# EAGLE design pcbnano (EAGLE 7.7.0)
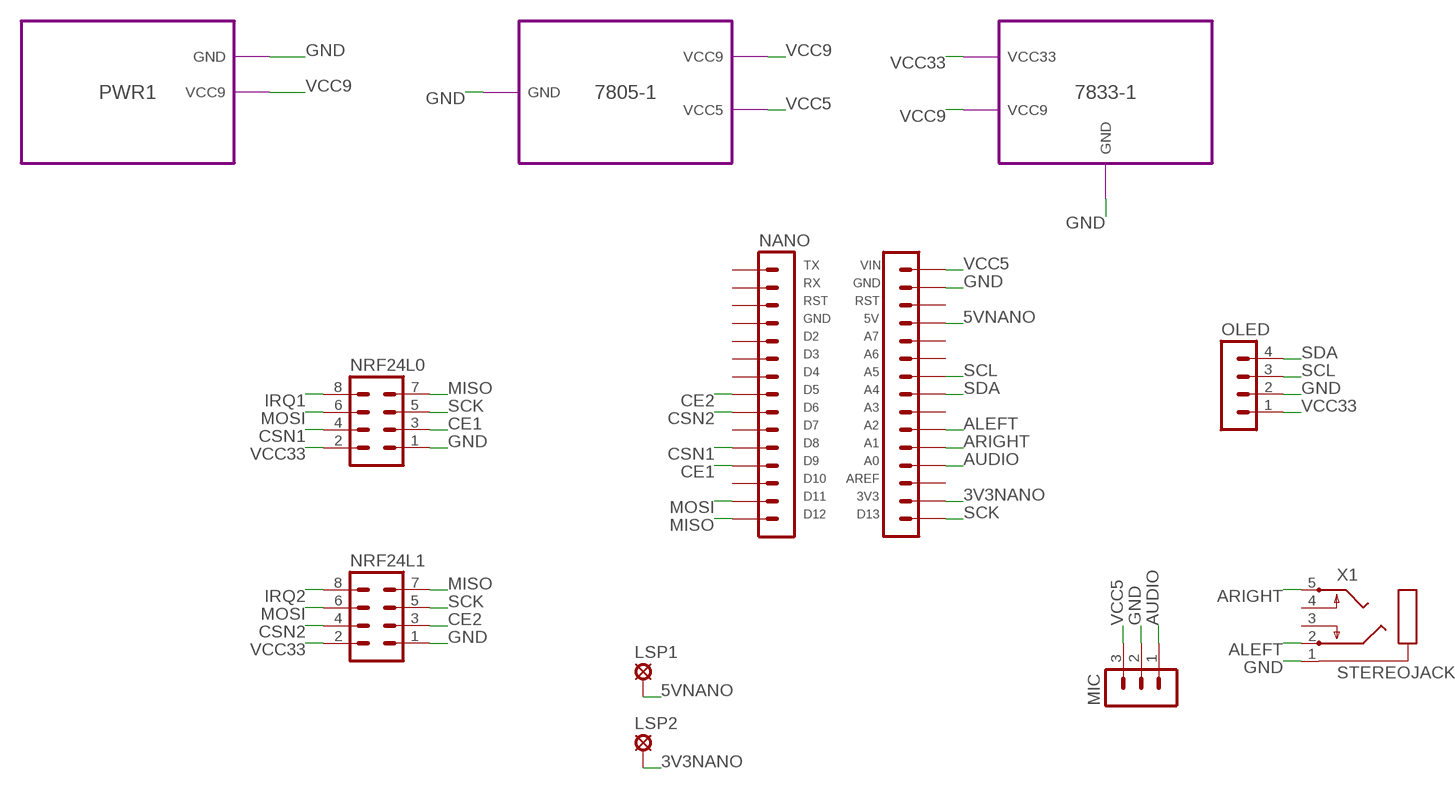
[diagram p0: schematic, sheet 1]

## Parts
LSP1  LSP10  [LSP10]
LSP2  LSP10  [LSP10]
MIC  MA03-1  [MA03-1]
NANO  ARD-NANO  [ARD-NANO]
NRF24L0  MA04-2  [MA04-2]
NRF24L1  MA04-2  [MA04-2]
OLED  MA04-1  [MA04-1]
X1  STEREOJACK  [STX3100]

## Module instances
7805-1 = 7805
7833-1 = 7833
PWR1 = PWR

## Nets
3V3NANO: LSP2.MP NANO.3V3
5VNANO: LSP1.MP NANO.5V
ALEFT: NANO.A2 X1.2
ARIGHT: NANO.A1 X1.5
AUDIO: MIC.1 NANO.A0
CE1: NANO.D9 NRF24L0.3
CE2: NANO.D5 NRF24L1.3
CSN1: NANO.D8 NRF24L0.4
CSN2: NANO.D6 NRF24L1.4
GND: MIC.2 NANO.GND2 NRF24L0.1 NRF24L1.1 OLED.2 X1.1 ; port PWR1.GND 7805-1.GND 7833-1.GND
IRQ1: NRF24L0.8
IRQ2: NRF24L1.8
MISO: NANO.D12 NRF24L0.7 NRF24L1.7
MOSI: NANO.D11 NRF24L0.6 NRF24L1.6
SCK: NANO.D13 NRF24L0.5 NRF24L1.5
SCL: NANO.A5 OLED.3
SDA: NANO.A4 OLED.4
VCC5: MIC.3 NANO.VIN ; port 7805-1.VCC5
VCC9: port PWR1.VCC9 7805-1.VCC9 7833-1.VCC9
VCC33: NRF24L0.2 NRF24L1.2 OLED.1 ; port 7833-1.VCC33
Unconnected: NANO.A3 NANO.A6 NANO.A7 NANO.AREF NANO.D2 NANO.D3 NANO.D4 NANO.D7 NANO.D10 NANO.GND1 NANO.RST1 NANO.RST2 NANO.RX NANO.TX X1.3 X1.4

## Library data of the parts
LSP1 LSP2 = solpad:LSP10: SOLDER PAD drill 1.0 mm, distributor Buerklin, 12H555
MIC = 00-con-lstb_edited_LongPadsSlk:MA03-1: PIN HEADER; OC_FARNELL: unknown; OC_NEWARK: unknown
NANO = #rcn-15:ARD-NANO
NRF24L0 NRF24L1 = con-lstb:MA04-2: PIN HEADER; OC_FARNELL: unknown; OC_NEWARK: unknown
OLED = con-lstb:MA04-1: PIN HEADER; OC_FARNELL: unknown; OC_NEWARK: unknown
X1 = adafruit:STEREOJACK: MIC/HEADPHONE JACK Stereo jack with two switches. Kycon STX3100, CUI SJ1-3555NG and/or 4UCon 05544

## Module 7805
Ports: VCC9(io) VCC5(io) GND(io)
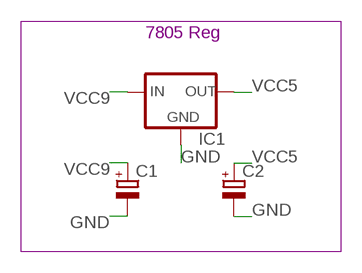
[diagram p1: schematic, module 7805, sheet 1]

### Parts
C1  CPOL-EUE2,5-6E  [E2,5-6E]
C2  CPOL-EUE2,5-6E  [E2,5-6E]
IC1  78XXS  [78XXS]

### Nets
GND: C1.- C2.- IC1.GND
VCC5: C2.+ IC1.OUT
VCC9: C1.+ IC1.IN

### Notes on the sheet
- 7805 Reg

### Library data of the parts
C1 C2 = rcl:CPOL-EU: POLARIZED CAPACITOR, European symbol
IC1 = v-reg:78XXS: VOLTAGE REGULATOR

## Module 7833
Ports: VCC33(io) VCC9(io) GND(io)
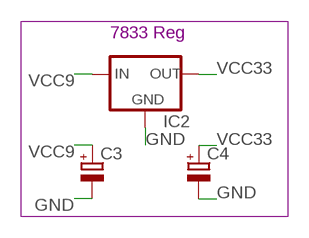
[diagram p2: schematic, module 7833, sheet 1]

### Parts
C3  CPOL-EUE2,5-6E  [E2,5-6E]
C4  CPOL-EUE2,5-6E  [E2,5-6E]
IC2  78XXS  [78XXS]

### Nets
GND: C3.- C4.- IC2.GND
VCC9: C3.+ IC2.IN
VCC33: C4.+ IC2.OUT

### Notes on the sheet
- 7833 Reg

### Library data of the parts
C3 C4 = rcl:CPOL-EU: POLARIZED CAPACITOR, European symbol
IC2 = v-reg:78XXS: VOLTAGE REGULATOR

## Module DAC558
Ports: 
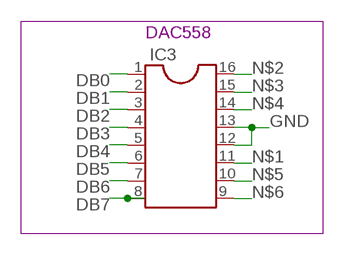
[diagram p3: schematic, module DAC558, sheet 1]

### Parts
IC3  DIL16S  [SOCKET-16]

### Nets
DB0: IC3.1
DB1: IC3.2
DB2: IC3.3
DB3: IC3.4
DB4: IC3.5
DB5: IC3.6
DB6: IC3.7
DB7: IC3.8
GND: IC3.12 IC3.13
N$1: IC3.11
N$2: IC3.16
N$3: IC3.15
N$4: IC3.14
N$5: IC3.10
N$6: IC3.9

### Notes on the sheet
- DAC558

### Library data of the parts
IC3 = ic-package:DIL16: Dual In Line / Socket

## Module PWR
Ports: VCC9(io) GND(io)
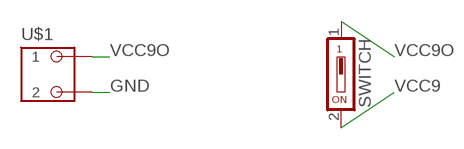
[diagram p4: schematic, module PWR, sheet 1]

### Parts
SWITCH  DS01  [DS-01]
U$1  SPTBB2-A2  [SPTB]

### Nets
GND: U$1.A2
VCC9: SWITCH.2
VCC9O: SWITCH.1 U$1.B2

### Library data of the parts
SWITCH = switch-dil:DS01: DIL/CODE SWITCH; OC_FARNELL: unknown; OC_NEWARK: unknown
U$1 = #rcn-15:SPTB

## Board
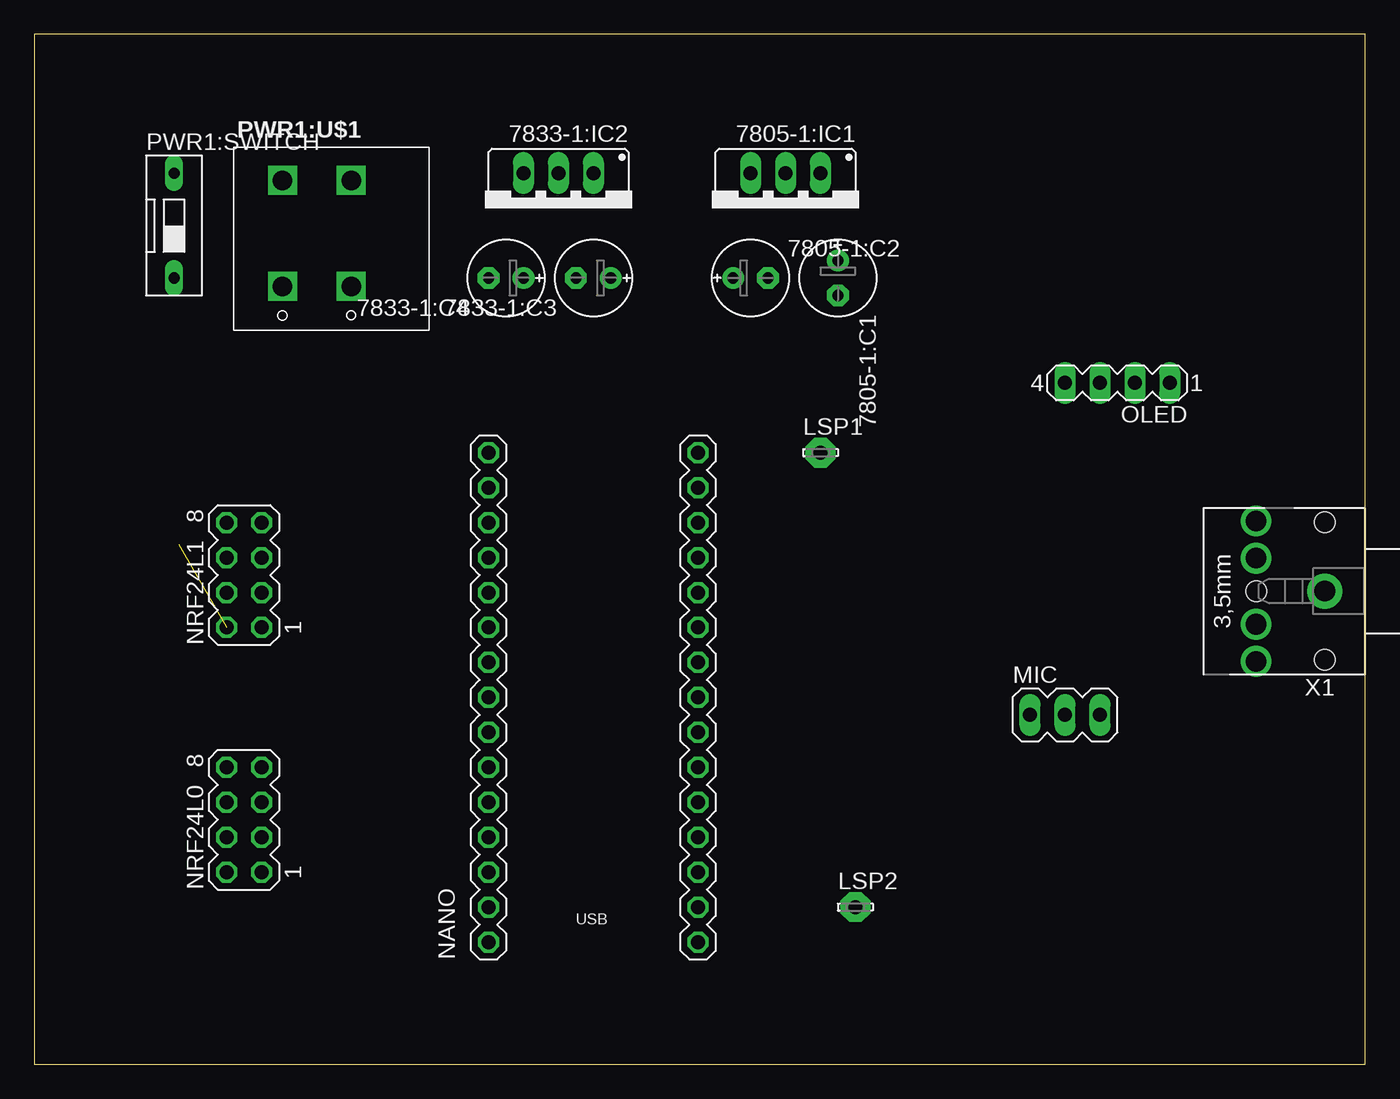
[diagram p5: board, top side]
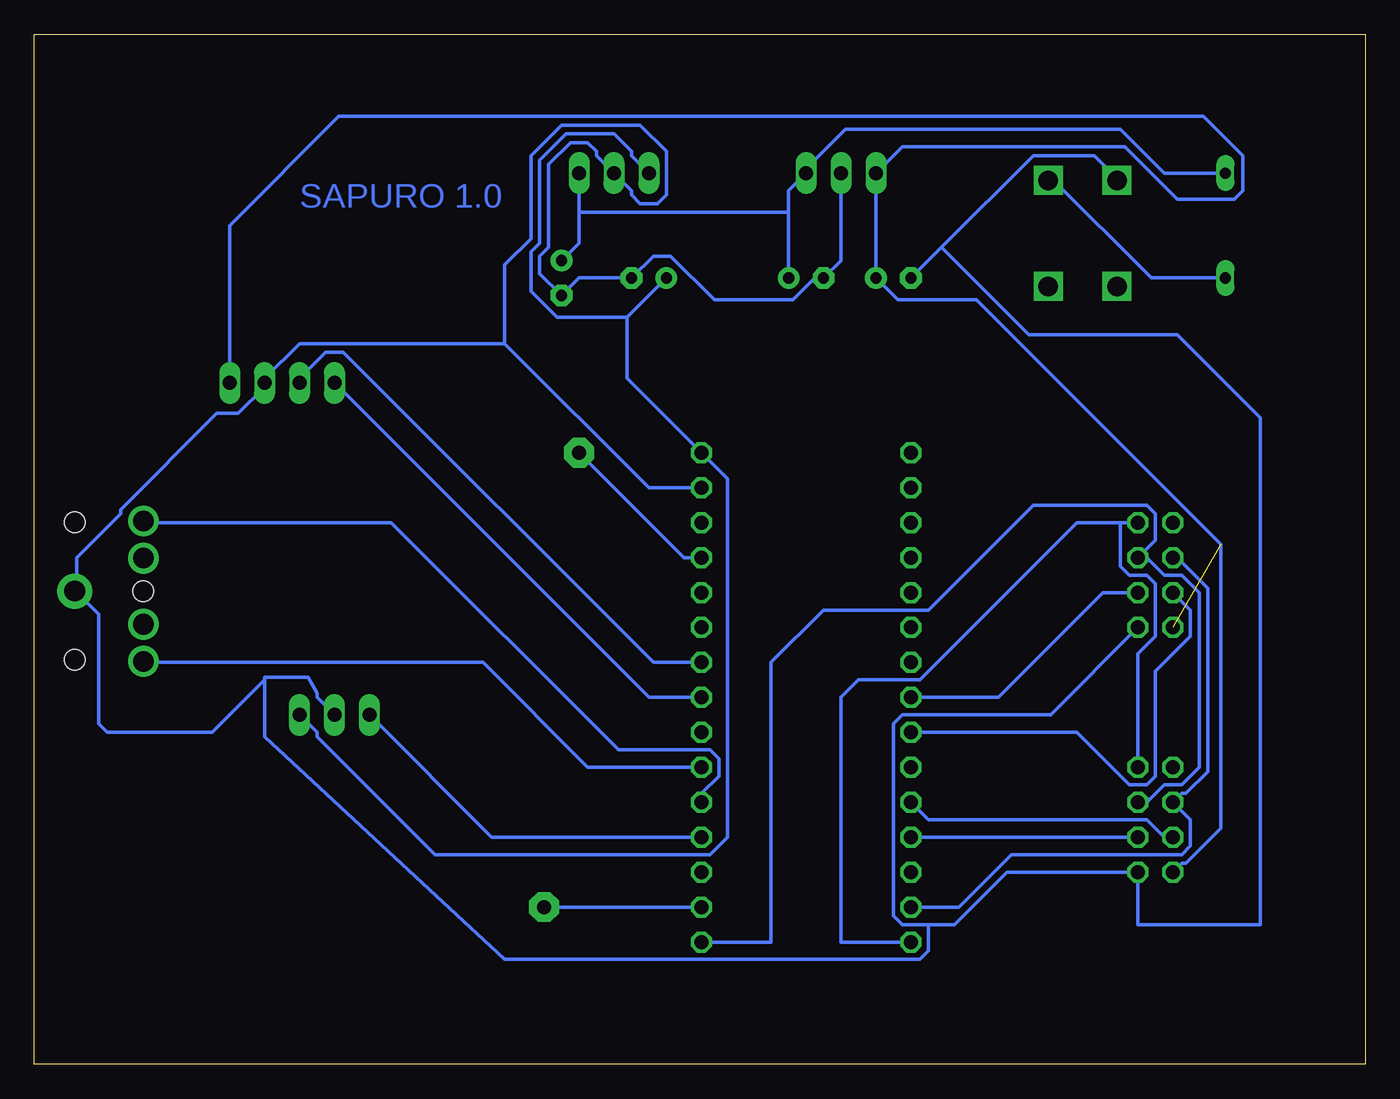
[diagram p6: board, bottom side, seen from below]

Size 96.75 x 74.85 mm. Coordinates in mm from the lower left corner, seen from the top.
Outline: 0,0 96.75,0 96.75,74.85 0,74.85 0,0
Copper layers (1*16): Top 0.035mm / dielectric 1.5mm / Bottom 0.035mm
Design rules "etch *": minimum track width 10mil, minimum drill 40mil, track to track 15mil, track to pad 15mil, pad to pad 8mil, via to via 8mil, smd to smd 8mil, copper to edge 40mil, drill to drill 12mil, minimum pad ring 10mil, minimum via ring 8mil, stop-mask expansion 4mil, vias tented up to drill 0mil, thermal gap 10mil

### Footprints (pad centres in the part's own frame; a part is rotated, then mirrored left to right if it is on the bottom)
E2,5-6E = drill 0.813 pad 1.575: + -1.27,0 | drill 0.813 pad 1.575 octagon: - 1.27,0
78XXS = drill 1.016 long: GND 0,-2.54; IN -2.54,-2.54; OUT 2.54,-2.54
LSP10 = drill 1.016 pad 2.159 octagon: MP 0,0
MA03-1 = drill 1.016 long: 1 -2.54,0; 2 0,0; 3 2.54,0
ARD-NANO = drill 1.016 octagon: 3V3 7.62,-15.24; 5V 7.62,10.16; A0 7.62,-10.16; A1 7.62,-7.62; A2 7.62,-5.08; A3 7.62,-2.54; A4 7.62,0; A5 7.62,2.54; A6 7.62,5.08; A7 7.62,7.62; AREF 7.62,-12.7; D2 -7.62,7.62; D3 -7.62,5.08; D4 -7.62,2.54; D5 -7.62,0; D6 -7.62,-2.54; D7 -7.62,-5.08; D8 -7.62,-7.62; D9 -7.62,-10.16; D10 -7.62,-12.7; D11 -7.62,-15.24; D12 -7.62,-17.78; D13 7.62,-17.78; GND1 -7.62,10.16; GND2 7.62,15.24; RST1 -7.62,12.7; RST2 7.62,12.7; RX -7.62,15.24; TX -7.62,17.78; VIN 7.62,17.78
MA04-2 = drill 1.016 octagon: 1 -3.81,-1.27; 2 -3.81,1.27; 3 -1.27,-1.27; 4 -1.27,1.27; 5 1.27,-1.27; 6 1.27,1.27; 7 3.81,-1.27; 8 3.81,1.27
MA04-1 = drill 1.016 long: 1 -3.81,0; 2 -1.27,0; 3 1.27,0; 4 3.81,0
DS-01 = drill 0.813 long: 1 0,-3.81; 2 0,3.81
SPTB = drill 1.4 square: A1 -2.28,-3.15; A2 -2.28,4.55; B1 2.72,-3.15; B2 2.72,4.55
STX3100 = drill 1.5 pad 2.54: 1 2.7,-0.1 | drill 1.5: 2 7.7,5; 3 7.7,2.3; 4 7.7,-2.5; 5 7.7,-5.2 | hole 1.5: 2.7,4.9; 2.7,-5.1; 7.7,-0.1

### Placement (x,y rotation side)
7805-1:C1  [E2,5-6E]  58.42,57.15 270 top
7805-1:C2  [E2,5-6E]  52.07,57.15 0 top
7805-1:IC1  [78XXS]  54.61,62.23 180 top
7833-1:C3  [E2,5-6E]  40.64,57.15 180 top
7833-1:C4  [E2,5-6E]  34.29,57.15 180 top
7833-1:IC2  [78XXS]  38.1,62.23 180 top
LSP1  57.15,44.45 0 top
LSP2  59.69,11.43 0 top
MIC  74.93,25.4 0 top
NANO  40.64,26.67 0 top
NRF24L0  15.24,17.78 90 top
NRF24L1  15.24,35.56 90 top
OLED  78.74,49.53 180 top
PWR1:SWITCH  [DS-01]  10.16,60.96 0 top
PWR1:U$1  SPTBB2-A2  [SPTB]  20.32,59.69 0 top
X1  96.52,34.29 180 top

### Tracks (layer width: path | path; a pad name or v marks a point on that pad's centre or on a via)
3V3NANO
  Bottom 0.254: LSP2.MP NANO.3V3
5VNANO
  Bottom 0.254: NANO.5V 49.53,36.83 LSP1.MP
ALEFT
  Bottom 0.254: NANO.A2 56.52,21.59 64.14,29.21 88.58,29.21 X1.2
ARIGHT
  Bottom 0.254: NANO.A1 48.26,19.69 46.99,20.95 46.99,22.23 47.62,22.86 54.29,22.86 70.8,39.37 88.58,39.37 X1.5
AUDIO
  Bottom 0.254: NANO.A0 63.5,16.51 MIC.1
CE1
  Bottom 0.254: NANO.D9 NRF24L0.3
CE2
  Bottom 0.254: NANO.D5 26.67,26.67 19.05,34.29 NRF24L1.3
CSN1
  Bottom 0.254: NRF24L0.4 14.61,16.51 15.88,17.78 31.75,17.78 NANO.D8
CSN2
  Bottom 0.254: NANO.D6 20.96,24.13 17.15,20.32 15.88,20.32 15.24,20.95 15.24,28.57 12.7,31.12 12.7,33.02 NRF24L1.4
GND
  Bottom 0.254: 30.8,59.37 24.13,66.04 19.69,66.04 18.1,64.45 PWR1:U$1.A2 | 30.8,59.37 7833-1:C4.- | 31.75,10.16 33.66,10.16 34.29,10.8 34.29,24.77 33.66,25.4 22.86,25.4 NRF24L1.1 | 31.75,10.16 29.85,10.16 26.04,13.97 NRF24L0.1 16.51,10.16 7.62,10.16 7.62,46.99 13.65,53.02 24.45,53.02 30.8,59.37 | MIC.2 76.2,26.67 76.2,26.99 76.84,28.13 80.01,28.13 80.01,27.94 | 7833-1:IC2.GND 38.1,58.42 7833-1:C3.- 40.01,57.15 41.59,55.56 47.31,55.56 50.48,58.74 51.75,58.74 7805-1:C2.- 57.15,57.15 7805-1:C1.- 60.01,57.47 60.01,58.74 59.37,59.37 59.37,65.41 57.79,66.99 56.52,66.99 55.88,66.36 55.88,66.04 7805-1:IC1.GND 53.34,63.5 53.34,63.18 52.71,62.55 51.44,62.55 50.8,63.18 50.8,66.36 52.71,68.26 58.42,68.26 60.64,66.04 60.64,60.01 62.55,58.1 62.55,52.39 | NANO.GND2 52.07,41.91 62.55,52.39 | 62.55,52.39 77.47,52.39 80.01,49.85 OLED.2 80.01,49.21 81.92,47.31 83.5,47.31 90.49,40.32 90.49,40.01 93.66,36.83 93.66,34.61 X1.1 93.66,34.29 92.08,32.7 92.08,24.77 91.44,24.13 83.82,24.13 80.01,27.94 | 31.75,10.16 31.75,8.26 32.39,7.62 62.55,7.62 80.01,23.81 80.01,27.94
MISO
  Bottom 0.254: NRF24L1.7 17.78,39.37 | 17.78,39.37 20.96,39.37 32.39,27.94 36.83,27.94 38.1,26.67 38.1,8.89 NANO.D12 | NRF24L0.7 16.51,29.85 15.24,31.12 15.24,34.92 15.88,35.56 17.15,35.56 17.78,36.2 17.78,39.37
MOSI
  Bottom 0.254: NRF24L1.6 13.65,36.83 11.43,34.61 11.43,21.27 13.02,19.69 13.34,19.69 NRF24L0.6 12.7,17.78 12.7,15.88 13.34,15.24 25.72,15.24 29.53,11.43 NANO.D11
PWR1:VCC9O
  Bottom 0.254: PWR1:SWITCH.1 15.56,57.15 22.86,64.45 PWR1:U$1.B2
SCK
  Bottom 0.254: 16.19,37.15 15.24,38.1 15.24,40.01 15.88,40.64 24.13,40.64 31.75,33.02 39.37,33.02 43.18,29.21 43.18,8.89 NANO.D13 | NRF24L0.5 15.88,19.05 14.61,20.32 13.34,20.32 12.07,21.59 12.07,34.29 13.34,35.56 14.61,35.56 16.19,37.15 | 16.19,37.15 NRF24L1.5
SCL
  Bottom 0.254: NANO.A5 51.75,29.21 74.3,51.75 75.56,51.75 77.47,49.85 OLED.3
SDA
  Bottom 0.254: NANO.A4 52.07,26.67 OLED.4
VCC5
  Bottom 0.254: 7805-1:IC1.OUT 53.34,66.04 53.34,66.36 54.61,67.63 58.1,67.63 60.01,65.72 60.01,59.69 60.64,59.05 60.64,56.2 58.74,54.29 53.66,54.29 | 7805-1:C2.+ 53.66,54.29 | MIC.3 76.2,24.13 76.2,23.81 67.63,15.24 47.62,15.24 46.36,16.51 46.36,42.55 NANO.VIN 53.66,49.85 53.66,54.29
VCC9
  Bottom 0.254: 57.15,61.91 57.15,59.69 7805-1:C1.+ | 57.15,61.91 7805-1:IC1.IN | PWR1:SWITCH.2 14.61,64.77 17.78,67.94 37.78,67.94 40.64,65.09 7833-1:IC2.IN 41.91,63.5 41.91,61.91 | 41.91,61.91 7833-1:C3.+ | 41.91,61.91 57.15,61.91
VCC33  (1 unrouted)
  Bottom 0.254: NRF24L0.2 13.34,14.61 13.02,14.61 10.48,17.15 10.48,37.78 28.26,55.56 33.97,55.56 7833-1:C4.+ 7833-1:IC2.OUT 33.66,66.68 17.46,66.68 13.65,62.87 9.53,62.87 8.89,63.5 8.89,66.04 11.75,68.9 74.61,68.9 82.55,60.96 OLED.1

### Text on the board
Bottom: SAPURO 1.0